# Altium schematic sheet reference.SchDoc
size A4
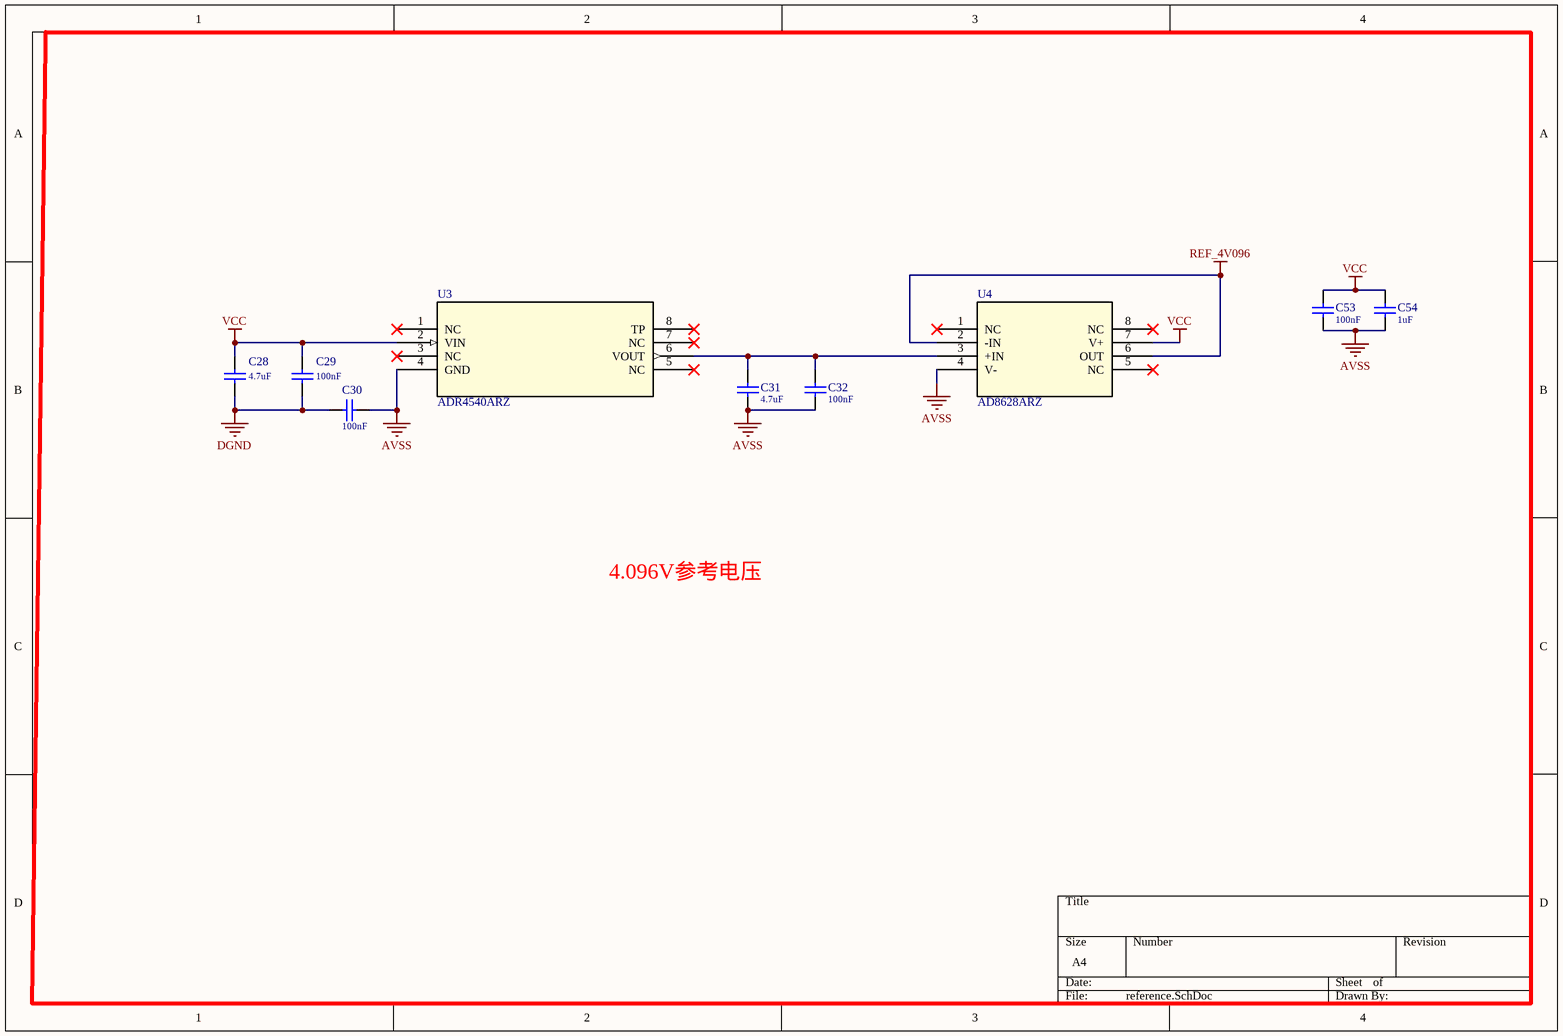
[diagram p0: reference.SchDoc]

## Parts
C28  value 4.7uF  [C0603-L]  (hidden comment: Cap-S)
C29  value 100nF  [C0603-L]  (hidden comment: Cap-S)
C30  value 100nF  [C0603-L]  (hidden comment: Cap-S)
C31  value 4.7uF  [C0603-L]  (hidden comment: Cap-S)
C32  value 100nF  [C0603-L]  (hidden comment: Cap-S)
C53  value 100nF  [C0603-L]  (hidden comment: Cap-S)
C54  value 1uF  [C0603-L]  (hidden comment: Cap-S)
U3  ADR4540ARZ  [R_8_ADI]
U4  AD8628ARZ  [R_8_ADI]

## Nets
AVSS: C30.1 C31.1 C32.1 C53.1 C54.1 U3.4(GND) U4.4(V-)
DGND: C28.1 C29.1 C30.2
REF_4V096: U4.2(-IN) U4.6(OUT)
VCC: C28.2 C29.2 C53.2 C54.2 U3.2(VIN) U4.7(V+)
NetC31_2: C31.2 C32.2 U3.6(VOUT) U4.3(+IN)

Not connected (* = marked no-connect by the designer): U3 1(NC)* 3(NC)* 5(NC)* 7(NC)* 8(TP)*; U4 1(NC)* 5(NC)* 8(NC)*

## Notes on the sheet
- 4.096V参考电压

## Library data of the parts
C28-C32 C53 C54 = Cap-S: 贴片瓷片电容
U3 = ADR4540ARZ: No Description Available; Mfr_Name: Analog Devices Inc; Copyright: Copyright (C) 2021 Ultra Librarian. All rights reserved.; Manufacturer_Part_Number: ADR4540ARZ; RefDes: RefDes; Type: DEV
U4 = AD8628ARZ: No Description Available; Mfr_Name: Analog Devices Inc; Copyright: Copyright (C) 2021 Ultra Librarian. All rights reserved.; Manufacturer_Part_Number: AD8628ARZ; RefDes: RefDes; Type: DEV